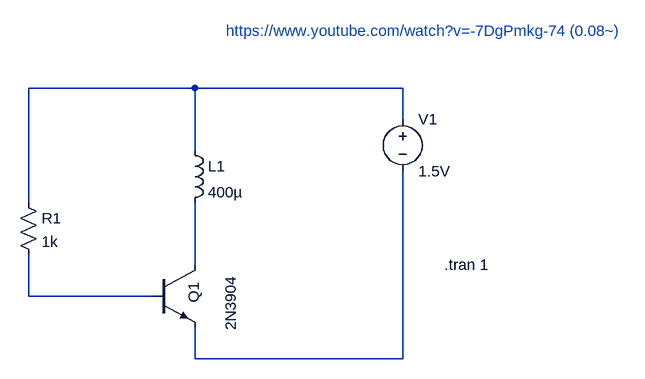
[diagram p0: schematic 37#24.5_2.(1).asc]
37#24.5_2.(1).asc, the LTspice schematic file:
Version 4
SHEET 1 880 680
WIRE -112 -432 -368 -432
WIRE 208 -432 -112 -432
WIRE 208 -384 208 -432
WIRE -112 -336 -112 -432
WIRE -368 -256 -368 -432
WIRE -112 -160 -112 -256
WIRE -368 -112 -368 -176
WIRE -176 -112 -368 -112
WIRE -112 -16 -112 -64
WIRE 208 -16 208 -304
WIRE 208 -16 -112 -16
SYMBOL npn -176 -160 R0
WINDOW 0 62 27 VRight 2
WINDOW 3 119 16 VRight 2
SYMATTR InstName Q1
SYMATTR Value 2N3904
SYMBOL voltage 208 -400 R0
WINDOW 123 0 0 Left 2
WINDOW 39 0 0 Left 2
SYMATTR InstName V1
SYMATTR Value 1.5V
SYMBOL res -384 -272 R0
SYMATTR InstName R1
SYMATTR Value 1k
SYMBOL ind -128 -352 R0
SYMATTR InstName L1
SYMATTR Value 400µ
TEXT 272 -160 Left 2 !.tran 1
TEXT -64 -520 Left 2 ;https://www.youtube.com/watch?v=-7DgPmkg-74 (0.08~)

The netlist it stands for:
* 37#24.5_2.(1).asc
Q1 N002 N003 N004 0 2N3904
V1 N001 N004 1.5V
R1 N001 N003 1k
L1 N001 N002 400µ
.model NPN NPN
.model PNP PNP
.lib standard.bjt
.tran 1
* https://www.youtube.com/watch?v=-7DgPmkg-74 (0.08~)
.backanno
.end